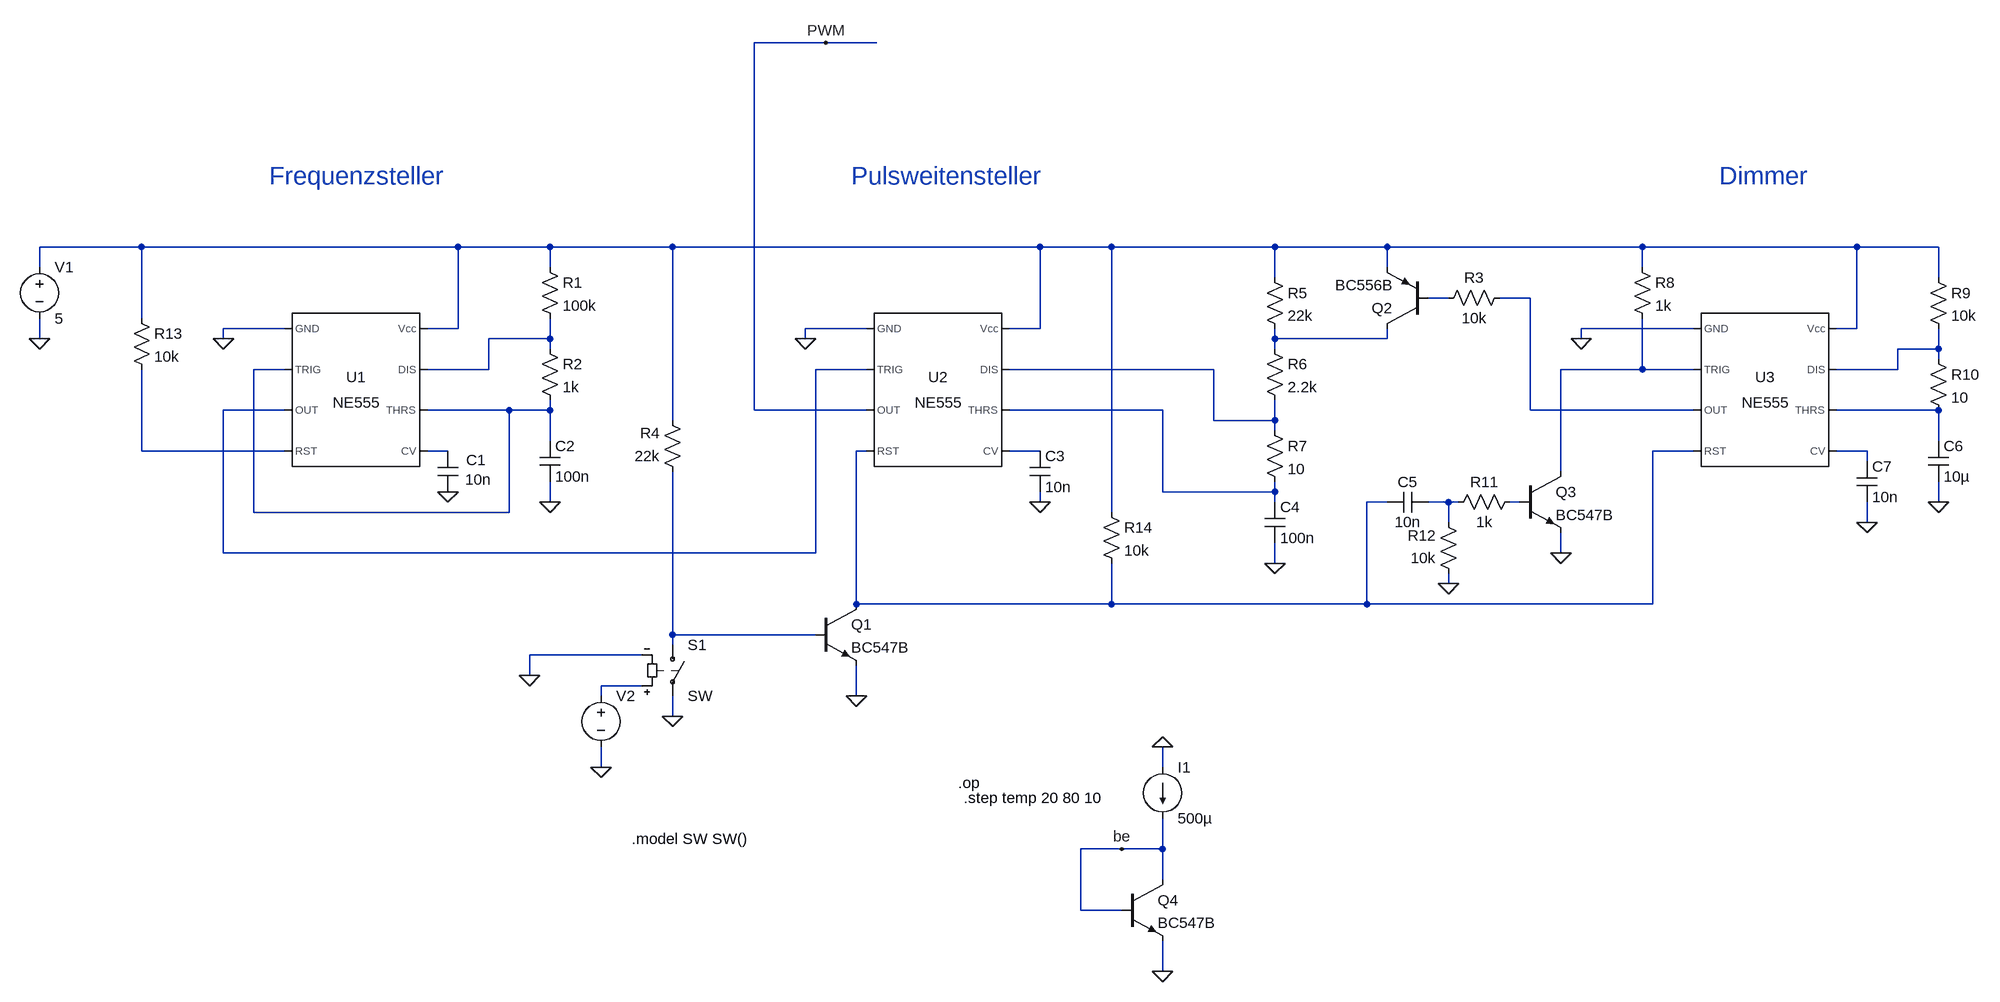
[diagram p0: schematic bl_pwm.asc]
bl_pwm.asc, the LTspice schematic file:
Version 4
SHEET 1 2660 1444
WIRE 720 -400 608 -400
WIRE 800 -400 720 -400
WIRE -352 -80 -512 -80
WIRE 144 -80 -352 -80
WIRE 288 -80 144 -80
WIRE 480 -80 288 -80
WIRE 1056 -80 480 -80
WIRE 1168 -80 1056 -80
WIRE 1424 -80 1168 -80
WIRE 1600 -80 1424 -80
WIRE 2000 -80 1600 -80
WIRE 2336 -80 2000 -80
WIRE 2464 -80 2336 -80
WIRE -512 -48 -512 -80
WIRE 288 -48 288 -80
WIRE 1600 -48 1600 -80
WIRE 2000 -48 2000 -80
WIRE 1424 -32 1424 -80
WIRE 2464 -32 2464 -80
WIRE 1696 0 1664 0
WIRE 1824 0 1776 0
WIRE -352 32 -352 -80
WIRE -128 48 -224 48
WIRE 144 48 144 -80
WIRE 144 48 96 48
WIRE 784 48 688 48
WIRE 1056 48 1056 -80
WIRE 1056 48 1008 48
WIRE 2080 48 1904 48
WIRE 2336 48 2336 -80
WIRE 2336 48 2304 48
WIRE -512 64 -512 32
WIRE -224 64 -224 48
WIRE 288 64 288 32
WIRE 288 64 192 64
WIRE 688 64 688 48
WIRE 1424 64 1424 48
WIRE 1600 64 1600 48
WIRE 1600 64 1424 64
WIRE 1904 64 1904 48
WIRE 288 80 288 64
WIRE 1424 80 1424 64
WIRE 2464 80 2464 48
WIRE 2464 80 2400 80
WIRE 2464 96 2464 80
WIRE -128 112 -176 112
WIRE 192 112 192 64
WIRE 192 112 96 112
WIRE 784 112 704 112
WIRE 1328 112 1008 112
WIRE 2000 112 2000 32
WIRE 2000 112 1872 112
WIRE 2080 112 2000 112
WIRE 2400 112 2400 80
WIRE 2400 112 2304 112
WIRE -128 176 -224 176
WIRE 224 176 96 176
WIRE 288 176 288 160
WIRE 288 176 224 176
WIRE 608 176 608 -400
WIRE 784 176 608 176
WIRE 1248 176 1008 176
WIRE 1824 176 1824 0
WIRE 2080 176 1824 176
WIRE 2464 176 2304 176
WIRE 480 192 480 -80
WIRE 1328 192 1328 112
WIRE 1424 192 1424 160
WIRE 1424 192 1328 192
WIRE 1424 208 1424 192
WIRE 288 224 288 176
WIRE 2464 224 2464 176
WIRE -352 240 -352 112
WIRE -128 240 -352 240
WIRE 128 240 96 240
WIRE 784 240 768 240
WIRE 1056 240 1008 240
WIRE 2080 240 2016 240
WIRE 2352 240 2304 240
WIRE 2352 256 2352 240
WIRE 1872 272 1872 112
WIRE 1248 304 1248 176
WIRE 1424 304 1424 288
WIRE 1424 304 1248 304
WIRE 288 320 288 288
WIRE 1056 320 1056 304
WIRE 1424 320 1424 304
WIRE 1600 320 1568 320
WIRE 1696 320 1664 320
WIRE 1712 320 1696 320
WIRE 1808 320 1792 320
WIRE 2464 320 2464 288
WIRE -176 336 -176 112
WIRE 224 336 224 176
WIRE 224 336 -176 336
WIRE 1168 336 1168 -80
WIRE 1696 352 1696 320
WIRE 2352 352 2352 320
WIRE -224 400 -224 176
WIRE 704 400 704 112
WIRE 704 400 -224 400
WIRE 1872 400 1872 368
WIRE 1424 416 1424 384
WIRE 1696 448 1696 432
WIRE 768 480 768 240
WIRE 1168 480 1168 416
WIRE 1168 480 768 480
WIRE 1568 480 1568 320
WIRE 1568 480 1168 480
WIRE 2016 480 2016 240
WIRE 2016 480 1568 480
WIRE 480 528 480 272
WIRE 704 528 480 528
WIRE 480 544 480 528
WIRE 432 560 256 560
WIRE 256 592 256 560
WIRE 432 608 368 608
WIRE 368 624 368 608
WIRE 768 624 768 576
WIRE 480 656 480 624
WIRE 368 736 368 704
WIRE 1248 736 1248 704
WIRE 1184 864 1120 864
WIRE 1248 864 1248 816
WIRE 1248 864 1184 864
WIRE 1248 912 1248 864
WIRE 1120 960 1120 864
WIRE 1184 960 1120 960
WIRE 1248 1056 1248 1008
FLAG -512 64 0
FLAG 128 304 0
FLAG 288 320 0
FLAG -224 64 0
FLAG 688 64 0
FLAG 1056 320 0
FLAG 1424 416 0
FLAG 1904 64 0
FLAG 2464 320 0
FLAG 1872 400 0
FLAG 1696 448 0
FLAG 720 -400 PWM
FLAG 480 656 0
FLAG 368 736 0
FLAG 256 592 0
FLAG 768 624 0
FLAG 2352 352 0
FLAG 1248 1056 0
FLAG 1248 704 0
FLAG 1184 864 be
SYMBOL Misc\\NE555 -16 144 R0
SYMATTR InstName U1
SYMBOL voltage -512 -64 R0
WINDOW 123 0 0 Left 2
WINDOW 39 0 0 Left 2
SYMATTR InstName V1
SYMATTR Value 5
SYMBOL res 272 -64 R0
SYMATTR InstName R1
SYMATTR Value 100k
SYMBOL res 272 64 R0
SYMATTR InstName R2
SYMATTR Value 1k
SYMBOL cap 112 240 R0
WINDOW 0 45 14 Left 2
WINDOW 3 43 45 Left 2
SYMATTR InstName C1
SYMATTR Value 10n
SYMBOL cap 272 224 R0
SYMATTR InstName C2
SYMATTR Value 100n
SYMBOL sw 480 528 R0
SYMATTR InstName S1
SYMBOL voltage 368 608 R0
WINDOW 3 24 96 Invisible 2
WINDOW 123 0 0 Left 2
WINDOW 39 0 0 Left 2
SYMATTR Value PWL(20m -1 20.1m 1 80m 1 80.1m -1 100m -1 100.1m 1 300m 1 300.1m -1 350m -1 350.1m 1)
SYMATTR InstName V2
SYMBOL npn 704 480 R0
SYMATTR InstName Q1
SYMATTR Value BC547B
SYMBOL res 496 288 R180
WINDOW 0 36 76 Left 2
WINDOW 3 36 40 Left 2
SYMATTR InstName R4
SYMATTR Value 22k
SYMBOL Misc\\NE555 896 144 R0
SYMATTR InstName U2
SYMBOL cap 1040 240 R0
SYMATTR InstName C3
SYMATTR Value 10n
SYMBOL res 1408 -48 R0
SYMATTR InstName R5
SYMATTR Value 22k
SYMBOL res 1408 64 R0
SYMATTR InstName R6
SYMATTR Value 2.2k
SYMBOL res 1408 192 R0
SYMATTR InstName R7
SYMATTR Value 10
SYMBOL cap 1408 320 R0
SYMATTR InstName C4
SYMATTR Value 100n
SYMBOL Misc\\NE555 2192 144 R0
SYMATTR InstName U3
SYMBOL pnp 1664 48 R180
SYMATTR InstName Q2
SYMATTR Value BC556B
SYMBOL res 1792 -16 R90
WINDOW 0 0 56 VBottom 2
WINDOW 3 32 56 VTop 2
SYMATTR InstName R3
SYMATTR Value 10k
SYMBOL res 1984 -64 R0
SYMATTR InstName R8
SYMATTR Value 1k
SYMBOL res 2448 -48 R0
SYMATTR InstName R9
SYMATTR Value 10k
SYMBOL res 2448 80 R0
SYMATTR InstName R10
SYMATTR Value 10
SYMBOL cap 2448 224 R0
SYMATTR InstName C6
SYMATTR Value 10µ
SYMBOL npn 1808 272 R0
SYMATTR InstName Q3
SYMATTR Value BC547B
SYMBOL res 1808 304 R90
WINDOW 0 0 56 VBottom 2
WINDOW 3 32 56 VTop 2
SYMATTR InstName R11
SYMATTR Value 1k
SYMBOL res 1712 448 R180
WINDOW 0 36 76 Left 2
WINDOW 3 36 40 Left 2
SYMATTR InstName R12
SYMATTR Value 10k
SYMBOL cap 1664 304 R90
WINDOW 0 0 32 VBottom 2
WINDOW 3 32 32 VTop 2
SYMATTR InstName C5
SYMATTR Value 10n
SYMBOL res -368 16 R0
SYMATTR InstName R13
SYMATTR Value 10k
SYMBOL cap 2336 256 R0
SYMATTR InstName C7
SYMATTR Value 10n
SYMBOL res 1152 320 R0
SYMATTR InstName R14
SYMATTR Value 10k
SYMBOL npn 1184 912 R0
SYMATTR InstName Q4
SYMATTR Value BC547B
SYMBOL current 1248 736 R0
WINDOW 123 0 0 Left 2
WINDOW 39 0 0 Left 2
SYMATTR InstName I1
SYMATTR Value 500µ
TEXT 928 760 Left 2 !.op
TEXT 416 848 Left 2 !.model SW SW()
TEXT 2120 -192 Left 4 ;Dimmer
TEXT 760 -192 Left 4 ;Pulsweitensteller
TEXT -152 -192 Left 4 ;Frequenzsteller
TEXT 936 784 Left 2 !.step temp 20 80 10

The netlist it stands for:
* bl_pwm.asc
XU1 0 N007 N008 N013 N014 N007 N004 N001 NE555  ; pins GND TRIG OUT RST CV THRS DIS Vcc
V1 N001 0 5
R1 N001 N004 100k
R2 N004 N007 1k
C1 N014 0 10n
C2 N007 0 100n
S1 N020 0 N021 0 SW
V2 N021 0 PWL(20m -1 20.1m 1 80m 1 80.1m -1 100m -1 100.1m 1 300m 1 300.1m -1 350m -1 350.1m 1)
Q1 N015 N020 0 0 BC547B
R4 N020 N001 22k
XU2 0 N008 PWM N015 N016 N011 N009 N001 NE555  ; pins GND TRIG OUT RST CV THRS DIS Vcc
C3 N016 0 10n
R5 N001 N005 22k
R6 N005 N009 2.2k
R7 N009 N011 10
C4 N011 0 100n
XU3 0 N010 N003 N015 N017 N012 N006 N001 NE555  ; pins GND TRIG OUT RST CV THRS DIS Vcc
Q2 N005 N002 N001 0 BC556B
R3 N003 N002 10k
R8 N001 N010 1k
R9 N001 N006 10k
R10 N006 N012 10
C6 N012 0 10µ
Q3 N010 N019 0 0 BC547B
R11 N019 N018 1k
R12 0 N018 10k
C5 N018 N015 10n
R13 N001 N013 10k
C7 N017 0 10n
R14 N001 N015 10k
Q4 be be 0 0 BC547B
I1 0 be 500µ
.model NPN NPN
.model PNP PNP
.lib standard.bjt
.op
.model SW SW()
* Dimmer
* Pulsweitensteller
* Frequenzsteller
.step temp 20 80 10
.lib NE555.sub
.backanno
.end